# Altium schematic sheet 7_VGA.SchDoc: AX309  Http://www.heijin.org
size OrCAD B; DocumentNumber: 7; SheetNumber: 7; SheetTotal: 7; PageSetup: Record=PageOptions|CenterHorizontal=True|CenterVertical=True|PrintScale=0.75|XCorrection=1.00|YCorrection=1.00|PrintKind=0|BorderSize=5000000|LeftOffset=0|BottomOffset=0|Orientation=2|PaperLength=1000|PaperWidth=1000|Scale=100|PaperSource=7|PrintQuality=-4|MediaType=1|DitherType=10|PrintScaleMode=1|PaperKind=A4|PaperIndex=9
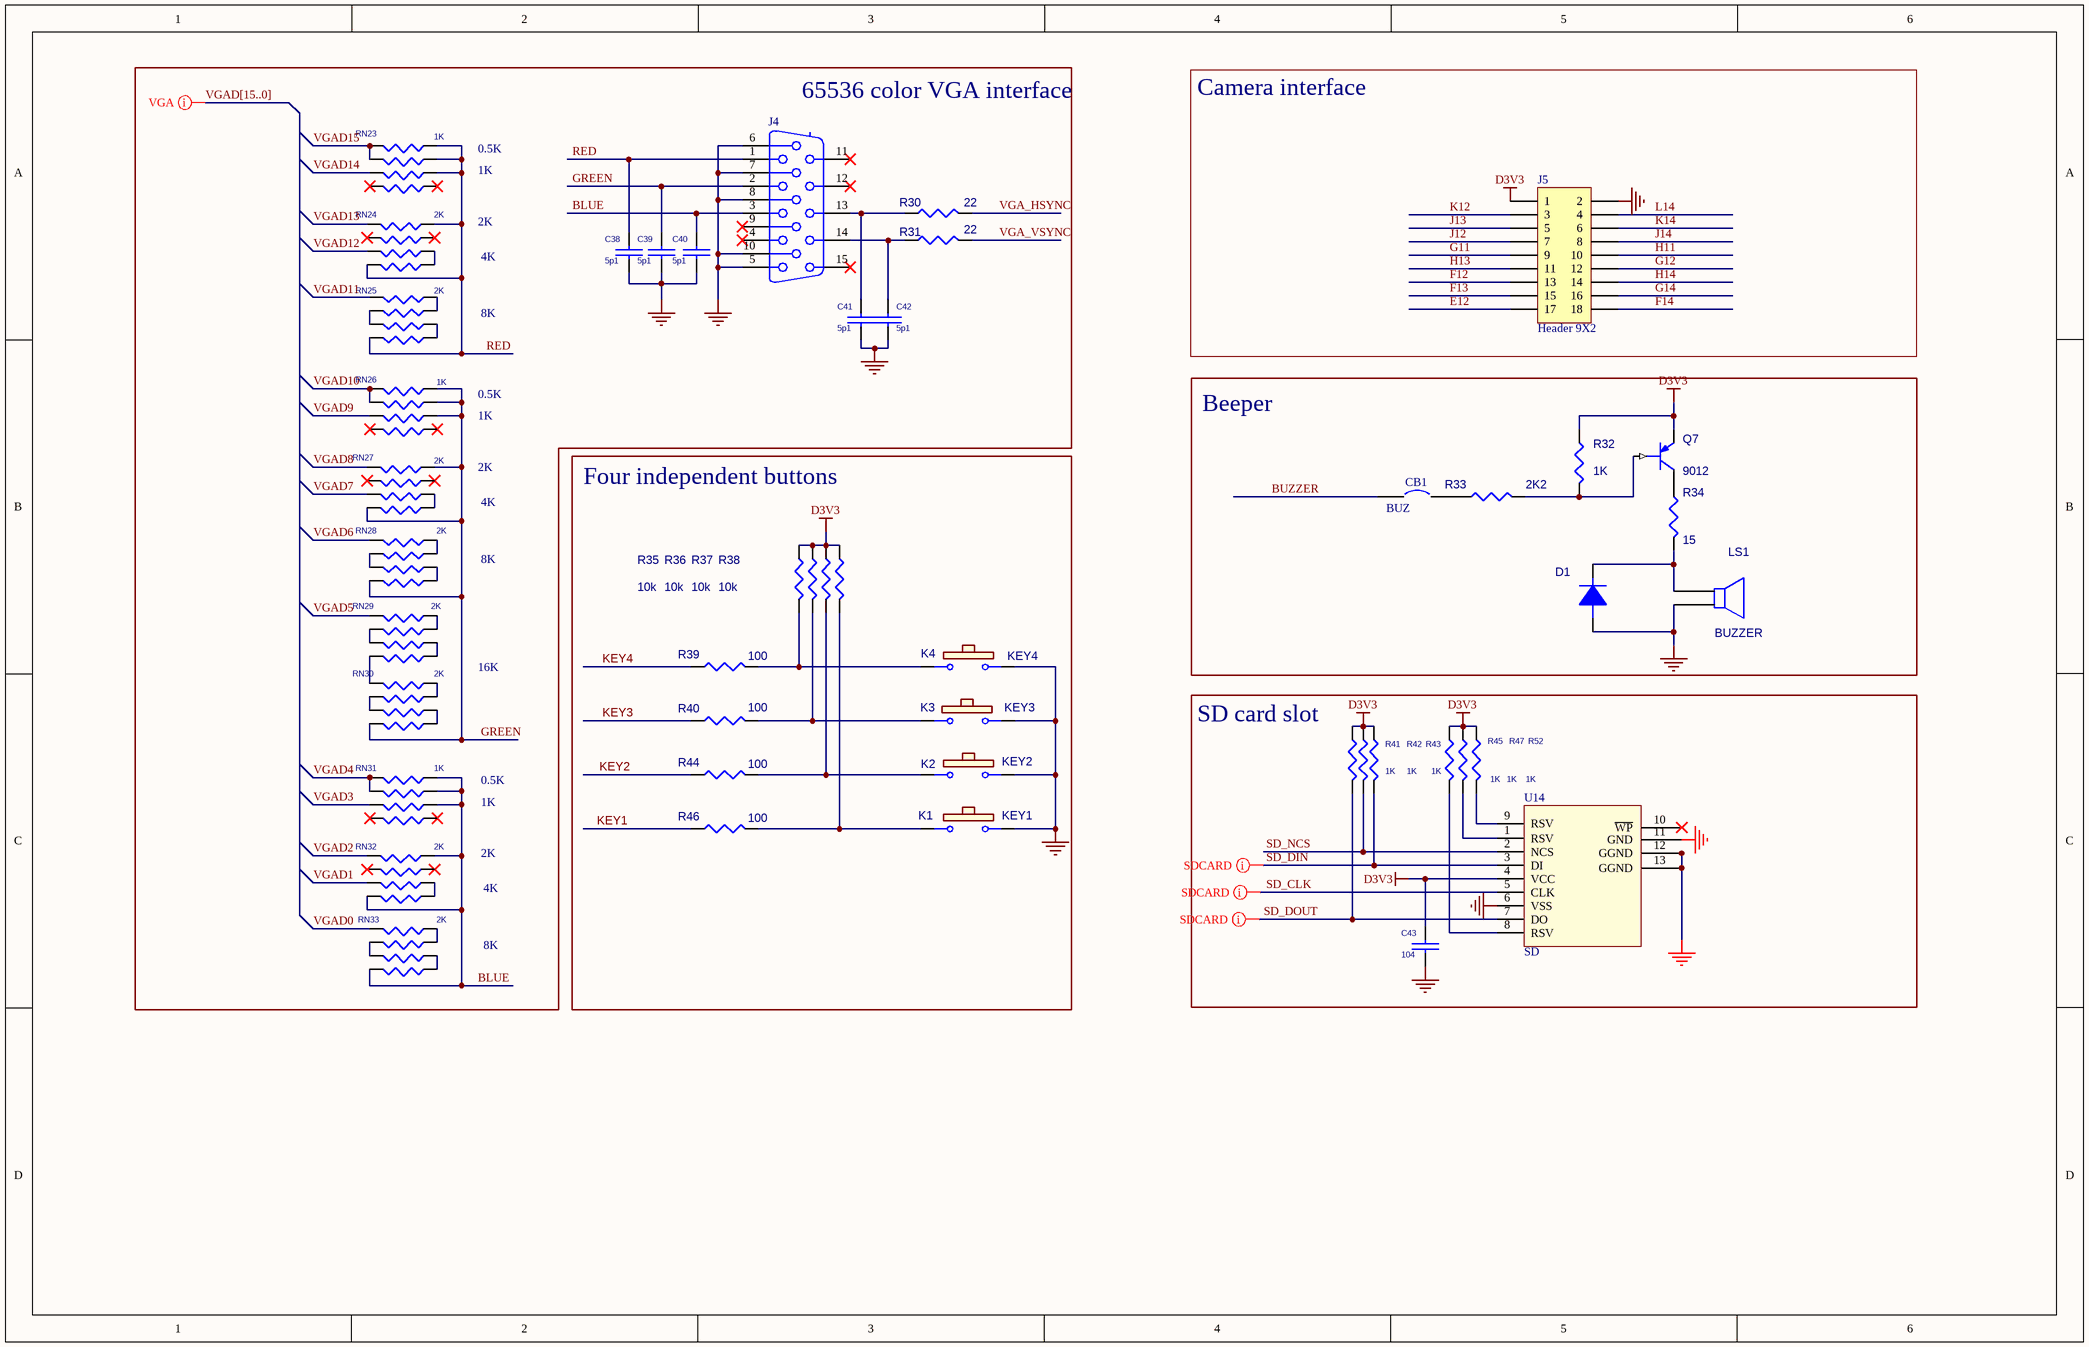
[diagram p0: 7_VGA.SchDoc]

## Parts
C38  5p1  [0603]
C39  5p1  [0603]
C40  5p1  [0603]
C41  5p1  [0603]
C42  5p1  [0603]
C43  104  [0402]
CB1  BUZ  [SIP2]
D1  (no value)  [1206]
J4  (no value)  [VGA]
J5  Header 9X2  [HDR2X9]
K1  KEY1  [KEY735SO]
K2  KEY2  [KEY735SO]
K3  KEY3  [KEY735SO]
K4  KEY4  [KEY735SO]
LS1  BUZZER  [BUZZER]
Q7  9012  [SOT23]
R30  22  [0603]
R31  22  [0603]
R32  1K  [0603]
R33  2K2  [0603]
R34  15  [0603]
R35  10k  [0603]
R36  10k  [0603]
R37  10k  [0603]
R38  10k  [0603]
R39  100  [0603]
R40  100  [0603]
R41  1K  [0603]
R42  1K  [0603]
R43  1K  [0603]
R44  100  [0603]
R45  1K  [0603]
R46  100  [0603]
R47  1K  [0603]
R52  1K  [0603]
RN23  1K  [RN-8P]
RN24  2K  [RN-8P]
RN25  2K  [RN-8P]
RN26  1K  [RN-8P]
RN27  2K  [RN-8P]
RN28  2K  [RN-8P]
RN29  2K  [RN-8P]
RN30  2K  [RN-8P]
RN31  1K  [RN-8P]
RN32  2K  [RN-8P]
RN33  2K  [RN-8P]
U14  SD  [TF]

## Blocks framed on the sheet
65536 color VGA interface: C38-C42 J4 R30 R31 RN23-RN33
Camera interface: J5
Beeper: CB1 D1 LS1 Q7 R32-R34
Four independent buttons: K1-K4 R35-R40 R44 R46
SD card slot: C43 R41-R43 R45 R47 R52 U14

## Nets
D3V3: C43.1 J5.1 Q7.2(EMITTER) R32.1 R35.1 R36.1 R37.1 R38.1 R41.1 R42.1 R43.1 R45.1 R47.1 R52.1 U14.4(VCC)
GND: C38.2 C39.2 C40.2 C41.2 C42.2 C43.2 D1.1(A) J4.5 J4.6 J4.7 J4.8 J4.10 J5.2 K1.2 K2.2 K3.1 K4.2 LS1.2 U14.6(VSS) U14.11(GND) U14.12(GGND) U14.13(GGND)
BLUE: C40.1 J4.3 RN31.2 RN31.3 RN31.4 RN32.4 RN32.8 RN33.8
BUZZER: CB1.1
E12: J5.17
F12: J5.13
F13: J5.15
F14: J5.18
G11: J5.9
G12: J5.12
G14: J5.16
GREEN: C39.1 J4.2 RN26.2 RN26.3 RN26.4 RN27.4 RN27.8 RN28.8 RN30.8
H11: J5.10
H13: J5.11
H14: J5.14
J12: J5.7
J13: J5.5
J14: J5.8
K12: J5.3
K14: J5.6
KEY1: R46.1
KEY2: R44.1
KEY3: R40.1
KEY4: R39.1
L14: J5.4
RED: C38.1 J4.1 RN23.2 RN23.3 RN23.4 RN24.4 RN24.8 RN25.8
SD_CLK: U14.5(CLK)
SD_DIN: R43.2 U14.3(DI)
SD_DOUT: R41.2 U14.7(DO)
SD_NCS: R42.2 U14.2(NCS)
VGA_HSYNC: R30.2
VGA_VSYNC: R31.2
VGAD0: RN33.5
VGAD1: RN32.7
VGAD2: RN32.5
VGAD3: RN31.7
VGAD4: RN31.5 RN31.6
VGAD5: RN29.5
VGAD6: RN28.5
VGAD7: RN27.7
VGAD8: RN27.5
VGAD9: RN26.7
VGAD10: RN26.5 RN26.6
VGAD11: RN25.5
VGAD12: RN24.7
VGAD13: RN24.5
VGAD14: RN23.7
VGAD15: RN23.5 RN23.6
NetC41_1: C41.1 J4.13 R30.1
NetC42_1: C42.1 J4.14 R31.1
NetCB1_2: CB1.2 R33.1
NetD1_2: D1.2(C) LS1.1 R34.2
NetK1_1: K1.1 R38.2 R46.2
NetK2_1: K2.1 R37.2 R44.2
NetK3_2: K3.2 R36.2 R40.2
NetK4_1: K4.1 R35.2 R39.2
NetQ7_1: Q7.1(BASE) R32.2 R33.2
NetQ7_3: Q7.3(COLLECTOR) R34.1
NetR45_2: R45.2 U14.8(RSV)
NetR47_2: R47.2 U14.1(RSV)
NetR52_2: R52.2 U14.9(RSV)
NetRN24_1: RN24.1 RN24.2
NetRN25_1: RN25.1 RN25.2
NetRN25_3: RN25.3 RN25.4
NetRN25_6: RN25.6 RN25.7
NetRN27_1: RN27.1 RN27.2
NetRN28_1: RN28.1 RN28.2
NetRN28_3: RN28.3 RN28.4
NetRN28_6: RN28.6 RN28.7
NetRN29_1: RN29.1 RN29.2
NetRN29_3: RN29.3 RN29.4
NetRN29_6: RN29.6 RN29.7
NetRN29_8: RN29.8 RN30.5
NetRN30_1: RN30.1 RN30.2
NetRN30_3: RN30.3 RN30.4
NetRN30_6: RN30.6 RN30.7
NetRN32_1: RN32.1 RN32.2
NetRN33_1: RN33.1 RN33.2
NetRN33_3: RN33.3 RN33.4
NetRN33_6: RN33.6 RN33.7

Not connected (* = marked no-connect by the designer): J4 4* 9* 11* 12* 15* 16(MH1) 17(MH2); RN23 1* 8*; RN24 3* 6*; RN26 1* 8*; RN27 3* 6*; RN31 1* 8*; RN32 3* 6*; U14 10(~{WP})*

## Buses and harness runs
bus VGAD[15..0]

## Layout directives
net class VGA; rule Matched Net Lengths [Tolerance = 100mil]: (no net found under the mark)
net class SDCARD; rule Matched Net Lengths [Tolerance = 100mil]: SD_CLK, SD_DIN, SD_DOUT

## Notes on the sheet
- 0.5K
- 1K
- 2K
- 4K
- 8K
- 16K
- Title
- Size:
- Date:
- Orcad B
- Number:
- Time:
- Revision:
- Sheet
- of
- File:

## Library data of the parts
C38-C43 = C_Dup1
CB1 = Circuit Breaker: Published: 24-Mar-1999; LatestRevisionDate: 17-Jul-2002; LatestRevisionNote: Re-released for DXP Platform.; PackageReference: SPST-2; Publisher: Altium Limited; PackageDescription: Switch; 2 Leads
D1 = 4148
J4 = Connector 15: Receptacle Assembly, 15-Pin, Sim Line Connector; PackageDocument: B; Positions: 15; Gender: Receptacle Header; Published: 15-Jun-2001; LatestRevisionDate: 17-Jul-2002; LatestRevisionNote: Re-released for DXP Platform.; DatasheetDocument: 24-Nov-1999; PackageReference: 788574; Publisher: Altium Limited; Orientation: Right Angle
J5 = Header 9X2: Header, 9-Pin, Dual row; LatestRevisionDate: 17-Jul-2002; LatestRevisionNote: Re-released for DXP Platform.; Publisher: Altium Limited
K1-K4 = KEYB
LS1 = SPEAKER
Q7 = PNP
R30 R31 R41-R43 R45 R47 R52 = R
R32-R34 = R_Dup3
R35-R40 R44 R46 = R_Dup2
RN23-RN33 = RN_Dup1